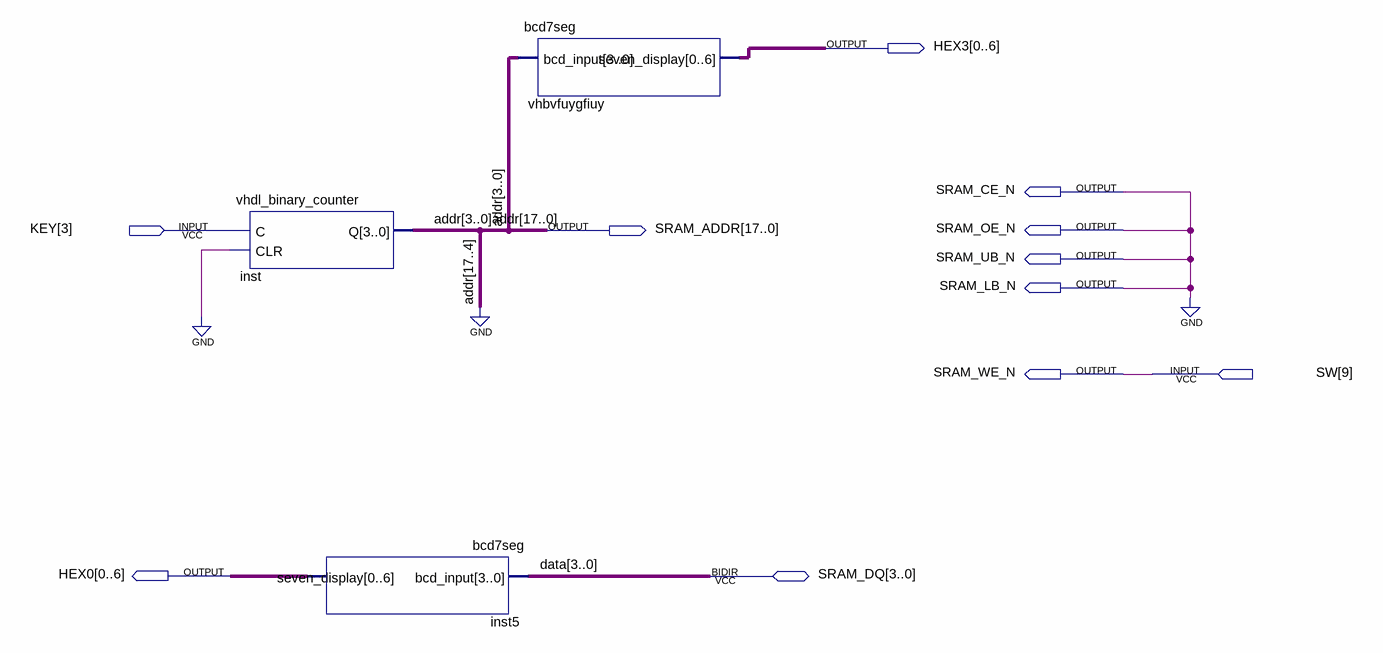
[diagram p0: schematic sheet]
// Quartus schematic test_ett_diagram.bdf as structural Verilog: 3 symbols, 11 pins
module test_ett_diagram (
  input  [3:3] KEY,
  input  [9:9] SW,
  inout  [3:0] SRAM_DQ,
  output [0:6] HEX3,
  output SRAM_CE_N,
  output [17:0] SRAM_ADDR,
  output SRAM_OE_N,
  output SRAM_UB_N,
  output SRAM_LB_N,
  output SRAM_WE_N,
  output [0:6] HEX0
);

  vhdl_binary_counter inst (.C(KEY[3]), .CLR(1'b0), .Q(SRAM_ADDR[3:0]));
  bcd7seg inst5 (.bcd_input(SRAM_DQ), .seven_display(HEX0));
  bcd7seg vhbvfuygfiuy (.bcd_input(SRAM_ADDR[3:0]), .seven_display(HEX3));

  assign SRAM_ADDR[17:4] = {14{1'b0}};
  assign SRAM_CE_N = 1'b0;
  assign SRAM_LB_N = 1'b0;
  assign SRAM_OE_N = 1'b0;
  assign SRAM_UB_N = 1'b0;
  assign SRAM_WE_N = SW[9];

  // Other names for the same wires on the sheet: addr[3:0] = SRAM_ADDR[3:0]; data[3:0] = SRAM_DQ
endmodule
